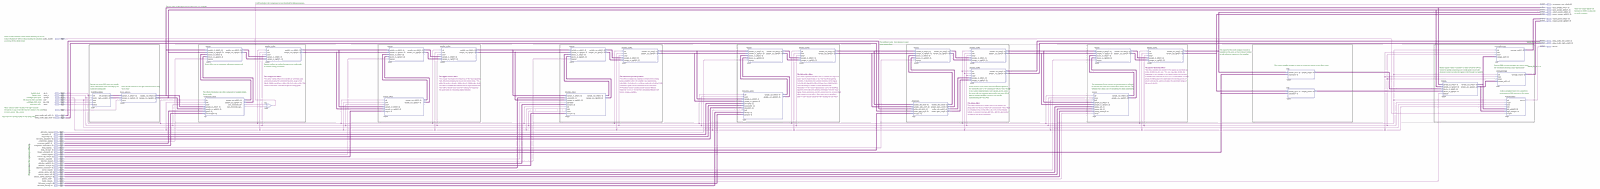
[diagram p0: schematic sheet, whole]
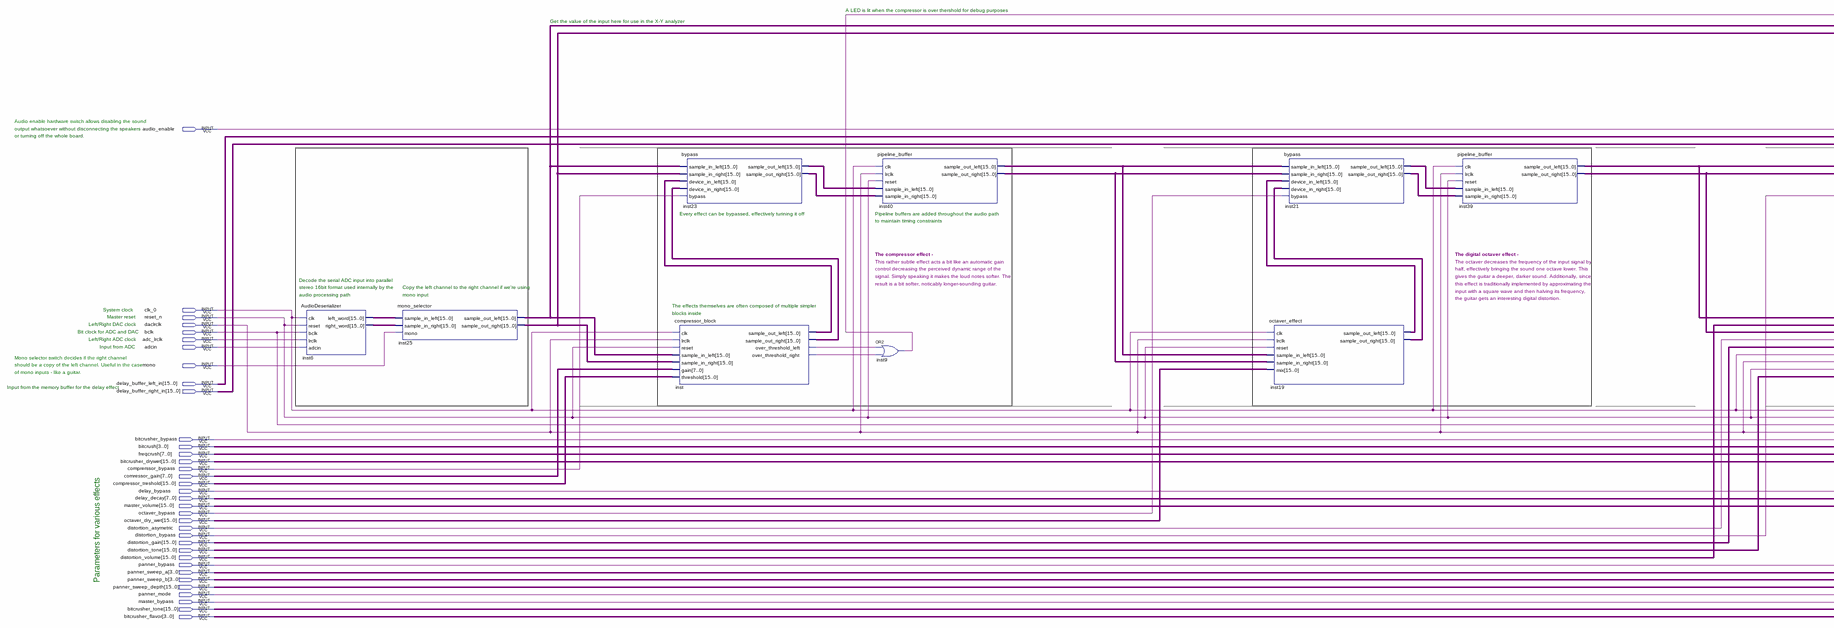
[diagram p1: schematic sheet, left part]
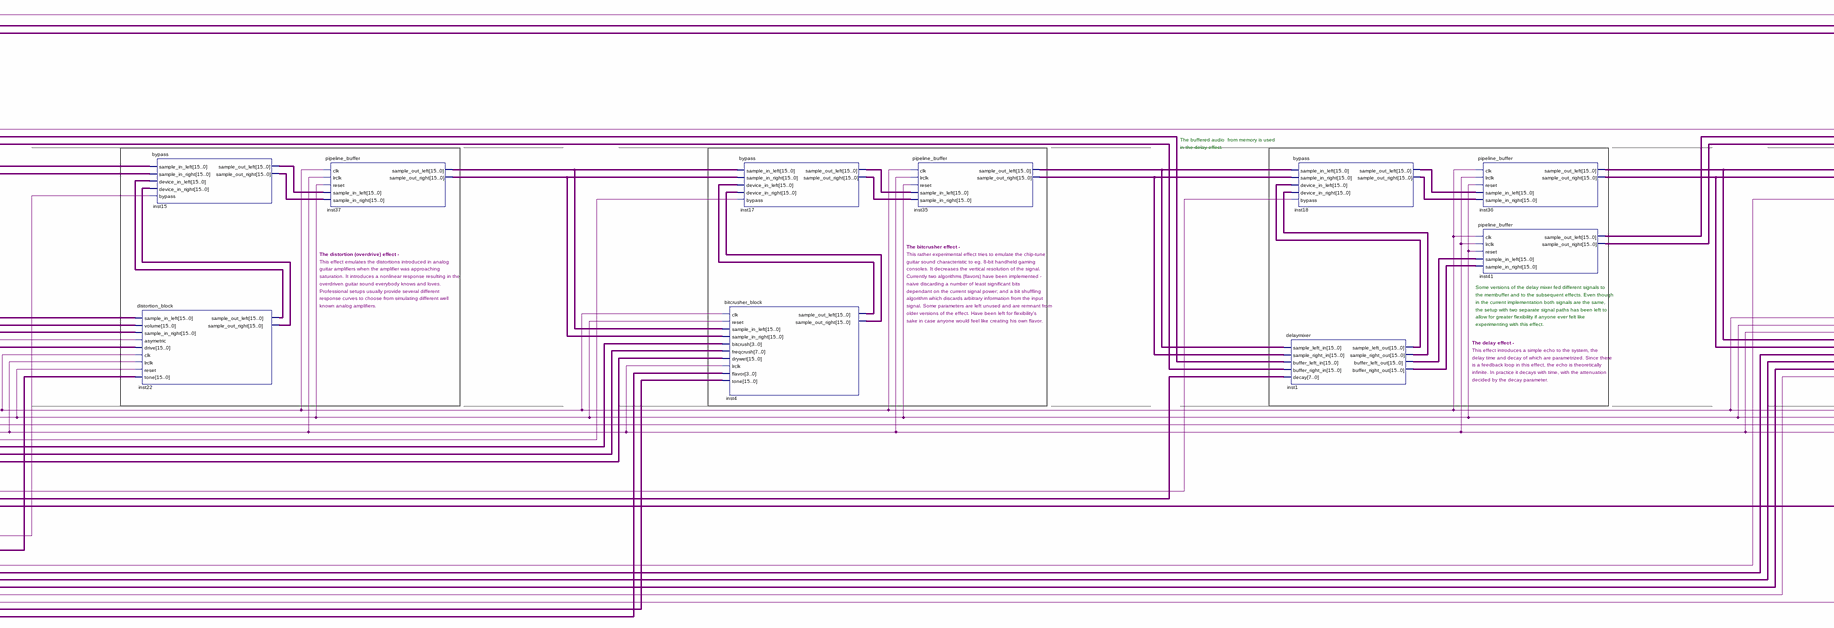
[diagram p2: schematic sheet, centre part]
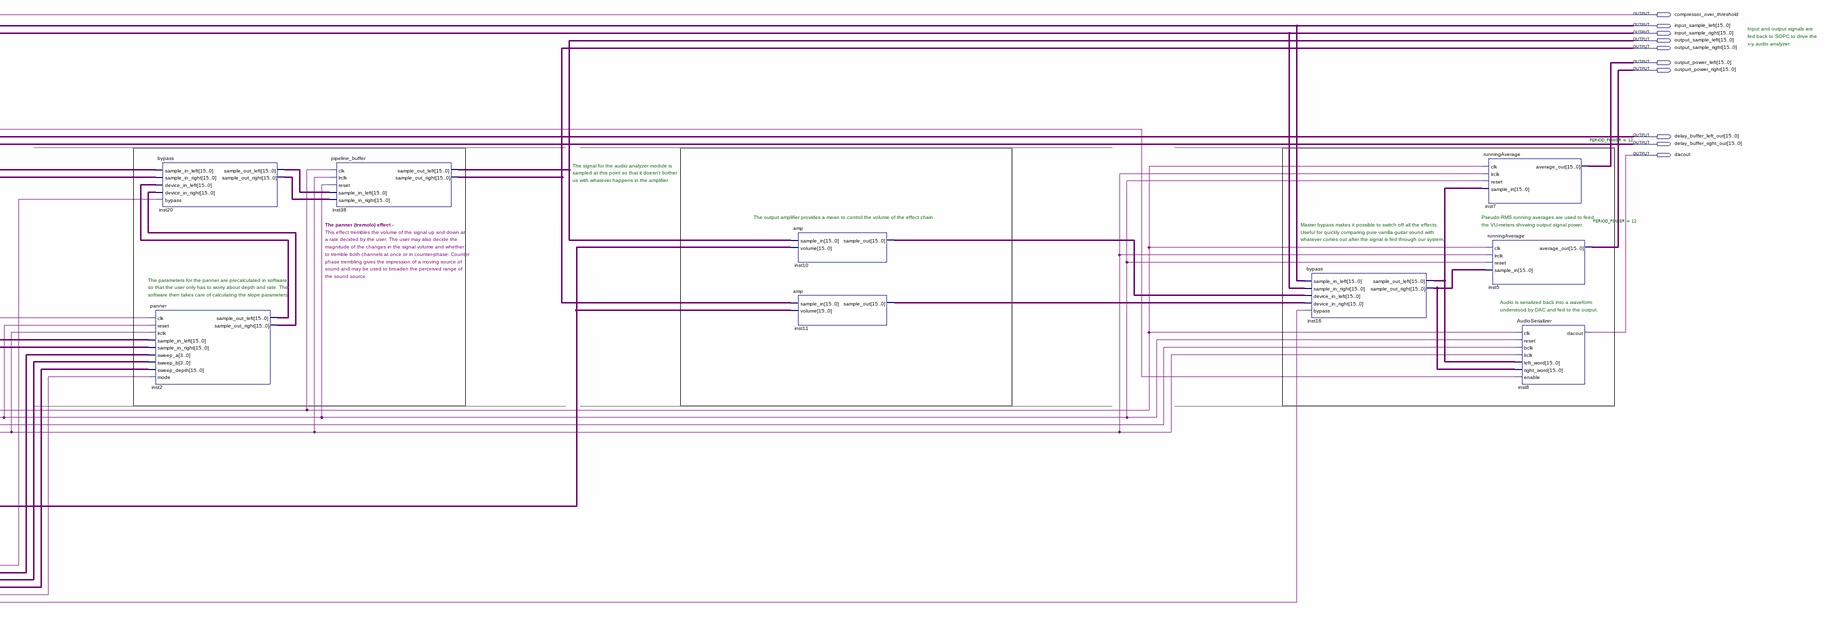
[diagram p3: schematic sheet, right part]
// Quartus schematic audio_two.bdf as structural Verilog: 28 symbols, 45 pins
module audio_two (
  input  audio_enable,
  input  clk_0,
  input  reset_n,
  input  daclrclk,
  input  bclk,
  input  adc_lrclk,
  input  adcin,
  input  mono,
  input  [15:0] delay_buffer_left_in,
  input  [15:0] delay_buffer_right_in,
  input  bitcrusher_bypass,
  input  [3:0] bitcrush,
  input  [7:0] freqcrush,
  input  [15:0] bitcrusher_drywet,
  input  comprerssor_bypass,
  input  [7:0] comressor_gain,
  input  [15:0] compressor_treshold,
  input  delay_bypass,
  input  [7:0] delay_decay,
  input  [15:0] master_volume,
  input  octaver_bypass,
  input  [15:0] octaver_dry_wet,
  input  distortion_asymetric,
  input  distortion_bypass,
  input  [15:0] distortion_gain,
  input  [15:0] distortion_tone,
  input  [15:0] distortion_volume,
  input  panner_bypass,
  input  [3:0] panner_sweep_a,
  input  [3:0] panner_sweep_b,
  input  [15:0] panner_sweep_depth,
  input  panner_mode,
  input  master_bypass,
  input  [15:0] bitcrusher_tone,
  input  [3:0] bitcrusher_flavor,
  output compressor_over_threshold,
  output [15:0] input_sample_left,
  output [15:0] input_sample_right,
  output [15:0] output_sample_left,
  output [15:0] output_sample_right,
  output [15:0] output_power_left,
  output [15:0] outpurt_power_right,
  output [15:0] delay_buffer_left_out,
  output [15:0] delay_buffer_right_out,
  output dacout
);

  wire inst_over_threshold_left, inst_over_threshold_right;
  wire [15:0] inst1_buffer_left_out, inst1_buffer_right_out, inst1_sample_left_out, inst1_sample_right_out,
       inst2_sample_out_left, inst2_sample_out_right, inst4_sample_out_left, inst4_sample_out_right,
       inst6_left_word, inst6_right_word, inst10_sample_out, inst11_sample_out, inst15_sample_out_left,
       inst15_sample_out_right, inst16_sample_out_left, inst16_sample_out_right, inst17_sample_out_left,
       inst17_sample_out_right, inst18_sample_out_left, inst18_sample_out_right, inst19_sample_out_left,
       inst19_sample_out_right, inst20_sample_out_left, inst20_sample_out_right, inst21_sample_out_left,
       inst21_sample_out_right, inst22_sample_out_left, inst22_sample_out_right, inst23_sample_out_left,
       inst23_sample_out_right, inst35_sample_out_left, inst35_sample_out_right, inst36_sample_out_left,
       inst36_sample_out_right, inst37_sample_out_left, inst37_sample_out_right, inst39_sample_out_left,
       inst39_sample_out_right, inst40_sample_out_left, inst40_sample_out_right, inst_sample_out_left,
       inst_sample_out_right;

  AudioDeserializer inst6 (
    .clk(clk_0), .reset(reset_n), .bclk(bclk), .lrclk(adc_lrclk), .adcin(adcin), .left_word(inst6_left_word),
    .right_word(inst6_right_word));
  mono_selector inst25 (
    .sample_in_left(inst6_left_word), .sample_in_right(inst6_right_word), .mono(mono),
    .sample_out_left(input_sample_left), .sample_out_right(input_sample_right));
  bypass inst23 (
    .sample_in_left(input_sample_left), .sample_in_right(input_sample_right),
    .device_in_left(inst_sample_out_left), .device_in_right(inst_sample_out_right),
    .bypass(comprerssor_bypass), .sample_out_left(inst23_sample_out_left),
    .sample_out_right(inst23_sample_out_right));
  compressor_block inst (
    .clk(clk_0), .lrclk(daclrclk), .reset(reset_n), .sample_in_left(input_sample_left),
    .sample_in_right(input_sample_right), .gain(comressor_gain), .threshold(compressor_treshold),
    .sample_out_left(inst_sample_out_left), .sample_out_right(inst_sample_out_right),
    .over_threshold_left(inst_over_threshold_left), .over_threshold_right(inst_over_threshold_right));
  pipeline_buffer inst40 (
    .clk(clk_0), .lrclk(daclrclk), .reset(reset_n), .sample_in_left(inst23_sample_out_left),
    .sample_in_right(inst23_sample_out_right), .sample_out_left(inst40_sample_out_left),
    .sample_out_right(inst40_sample_out_right));
  or inst9 (compressor_over_threshold, inst_over_threshold_left, inst_over_threshold_right);
  bypass inst21 (
    .sample_in_left(inst40_sample_out_left), .sample_in_right(inst40_sample_out_right),
    .device_in_left(inst19_sample_out_left), .device_in_right(inst19_sample_out_right),
    .bypass(octaver_bypass), .sample_out_left(inst21_sample_out_left),
    .sample_out_right(inst21_sample_out_right));
  octaver_effect inst19 (
    .clk(clk_0), .lrclk(daclrclk), .reset(reset_n), .sample_in_left(inst40_sample_out_left),
    .sample_in_right(inst40_sample_out_right), .mix(octaver_dry_wet),
    .sample_out_left(inst19_sample_out_left), .sample_out_right(inst19_sample_out_right));
  pipeline_buffer inst39 (
    .clk(clk_0), .lrclk(daclrclk), .reset(reset_n), .sample_in_left(inst21_sample_out_left),
    .sample_in_right(inst21_sample_out_right), .sample_out_left(inst39_sample_out_left),
    .sample_out_right(inst39_sample_out_right));
  distortion_block inst22 (
    .sample_in_left(inst39_sample_out_left), .volume(distortion_volume),
    .sample_in_right(inst39_sample_out_right), .asymetric(distortion_asymetric), .drive(distortion_gain),
    .clk(clk_0), .lrclk(daclrclk), .reset(reset_n), .tone(distortion_tone),
    .sample_out_left(inst22_sample_out_left), .sample_out_right(inst22_sample_out_right));
  bypass inst15 (
    .sample_in_left(inst39_sample_out_left), .sample_in_right(inst39_sample_out_right),
    .device_in_left(inst22_sample_out_left), .device_in_right(inst22_sample_out_right),
    .bypass(distortion_bypass), .sample_out_left(inst15_sample_out_left),
    .sample_out_right(inst15_sample_out_right));
  pipeline_buffer inst37 (
    .clk(clk_0), .lrclk(daclrclk), .reset(reset_n), .sample_in_left(inst15_sample_out_left),
    .sample_in_right(inst15_sample_out_right), .sample_out_left(inst37_sample_out_left),
    .sample_out_right(inst37_sample_out_right));
  bitcrusher_block inst4 (
    .clk(clk_0), .reset(reset_n), .sample_in_left(inst37_sample_out_left),
    .sample_in_right(inst37_sample_out_right), .bitcrush(bitcrush), .freqcrush(freqcrush),
    .drywet(bitcrusher_drywet), .lrclk(daclrclk), .flavor(bitcrusher_flavor), .tone(bitcrusher_tone),
    .sample_out_left(inst4_sample_out_left), .sample_out_right(inst4_sample_out_right));
  bypass inst17 (
    .sample_in_left(inst37_sample_out_left), .sample_in_right(inst37_sample_out_right),
    .device_in_left(inst4_sample_out_left), .device_in_right(inst4_sample_out_right),
    .bypass(bitcrusher_bypass), .sample_out_left(inst17_sample_out_left),
    .sample_out_right(inst17_sample_out_right));
  pipeline_buffer inst35 (
    .clk(clk_0), .lrclk(daclrclk), .reset(reset_n), .sample_in_left(inst17_sample_out_left),
    .sample_in_right(inst17_sample_out_right), .sample_out_left(inst35_sample_out_left),
    .sample_out_right(inst35_sample_out_right));
  bypass inst18 (
    .sample_in_left(inst35_sample_out_left), .sample_in_right(inst35_sample_out_right),
    .device_in_left(inst1_sample_left_out), .device_in_right(inst1_sample_right_out), .bypass(delay_bypass),
    .sample_out_left(inst18_sample_out_left), .sample_out_right(inst18_sample_out_right));
  delaymixer inst1 (
    .sample_left_in(inst35_sample_out_left), .sample_right_in(inst35_sample_out_right),
    .buffer_left_in(delay_buffer_left_in), .buffer_right_in(delay_buffer_right_in), .decay(delay_decay),
    .sample_left_out(inst1_sample_left_out), .sample_right_out(inst1_sample_right_out),
    .buffer_left_out(inst1_buffer_left_out), .buffer_right_out(inst1_buffer_right_out));
  pipeline_buffer inst36 (
    .clk(clk_0), .lrclk(daclrclk), .reset(reset_n), .sample_in_left(inst18_sample_out_left),
    .sample_in_right(inst18_sample_out_right), .sample_out_left(inst36_sample_out_left),
    .sample_out_right(inst36_sample_out_right));
  pipeline_buffer inst41 (
    .clk(clk_0), .lrclk(daclrclk), .reset(reset_n), .sample_in_left(inst1_buffer_left_out),
    .sample_in_right(inst1_buffer_right_out), .sample_out_left(delay_buffer_left_out),
    .sample_out_right(delay_buffer_right_out));
  panner inst2 (
    .clk(clk_0), .reset(reset_n), .lrclk(daclrclk), .sample_in_left(inst36_sample_out_left),
    .sample_in_right(inst36_sample_out_right), .sweep_a(panner_sweep_a), .sweep_b(panner_sweep_b),
    .sweep_depth(panner_sweep_depth), .mode(panner_mode), .sample_out_left(inst2_sample_out_left),
    .sample_out_right(inst2_sample_out_right));
  bypass inst20 (
    .sample_in_left(inst36_sample_out_left), .sample_in_right(inst36_sample_out_right),
    .device_in_left(inst2_sample_out_left), .device_in_right(inst2_sample_out_right), .bypass(panner_bypass),
    .sample_out_left(inst20_sample_out_left), .sample_out_right(inst20_sample_out_right));
  pipeline_buffer inst38 (
    .clk(clk_0), .lrclk(daclrclk), .reset(reset_n), .sample_in_left(inst20_sample_out_left),
    .sample_in_right(inst20_sample_out_right), .sample_out_left(output_sample_left),
    .sample_out_right(output_sample_right));
  amp inst10 (.sample_in(output_sample_left), .volume(master_volume), .sample_out(inst10_sample_out));
  amp inst11 (.sample_in(output_sample_right), .volume(master_volume), .sample_out(inst11_sample_out));
  bypass inst16 (
    .sample_in_left(input_sample_left), .sample_in_right(input_sample_right),
    .device_in_left(inst10_sample_out), .device_in_right(inst11_sample_out), .bypass(master_bypass),
    .sample_out_left(inst16_sample_out_left), .sample_out_right(inst16_sample_out_right));
  runningAverage #(.PERIOD_POWER(12)) inst7 (
    .clk(clk_0), .lrclk(daclrclk), .reset(reset_n), .sample_in(inst16_sample_out_left),
    .average_out(output_power_left));
  runningAverage #(.PERIOD_POWER(12)) inst5 (
    .clk(clk_0), .lrclk(daclrclk), .reset(reset_n), .sample_in(inst16_sample_out_right),
    .average_out(outpurt_power_right));
  AudioSerializer inst8 (
    .clk(clk_0), .reset(reset_n), .bclk(bclk), .lrclk(daclrclk), .left_word(inst16_sample_out_left),
    .right_word(inst16_sample_out_right), .enable(audio_enable), .dacout(dacout));

  // Notes on the sheet:
  //   A LED is lit when the compressor is over thershold for debug purposes
  //   Get the value of the input here for use in the X-Y analyzer
  //   Input and output signals are
  //   fed back to SOPC to drive the
  //   x-y audio analyzer.
  //   Audio enable hardware switch allows disabling the sound
  //   output whatsoever without disconnecting the speakers
  //   or turning off the whole board.
  //   The buffered audio  from memory is used
  //   in the delay effect
  //   The signal for the audio analyzer module is
  //   sampled at this point so that it doesn't bother
  //   us with whatever happens in the amplifier.
  //   Every effect can be bypassed, effectively turining it off
  //   Pipeline buffers are added throughout the audio path
  //   The output amplifier provides a mean to control the volume of the effect chain.
  //   Pseudo-RMS running averages are used to feed
  //   to maintain timing constraints
  //   The panner (tremolo) effect -
  //   Master bypass makes it possible to switch off all the effects.
  //   the VU-meters showing output signal power.
  //   This effect trembles the volume of the signal up and down at
  //   Useful for quickly comparing pure vanilla guitar sound with
  //   a rate decided by the user. The user may also decide the
  //   whatever comes out after the signal is fed through our system.
  //   The bitcrusher effect -
  //   magnitude of the changes in the signal volume and whether
  //   The compressor effect -
  //   The digital octaver effect -
  //   The distortion (overdrive) effect -
  //   This rather experimental effect tries to emulate the chip-tune
  //   to tremble both channels at once or in counter-phase. Counter
  //   This rather subtle effect acts a bit like an automatic gain
  //   The octaver decreases the frequency of the input signal by
  //   This effect emulates the distortions introduced in analog
  //   guitar sound characteristic to eg. 8-bit handheld gaming
  //   phase trembling gives the impression of a moving source of
  //   control decreasing the perceived dynamic range of the
  //   half, effectively bringing the sound one octave lower. This
  //   guitar amplifiers when the amplifier was approaching
  //   consoles. It decreases the vertical resolution of the signal.
  //   sound and may be used to broaden the perceived range of
  //   signal. Simply speaking it makes the loud notes softer. The
  //   gives the guitar a deeper, darker sound. Additionally, since
  //   saturation. It introduces a nonlinear response resulting in the
  //   Currently two algorithms (flavors) have been implemented -
  //   the sound source.
  //   Decode the serial ADC input into parallel
  //   The parameters for the panner are precalculated in software
  //   result is a bit softer, noticably longer-sounding guitar.
  //   this effect is traditionally implemented by approximating the
  //   overdriven guitar sound everybody knows and loves.
  //   naive discarding a number of least significant bits
  //   stereo 16bit format used internally by the
  //   Copy the left channel to the right channel if we're using
  //   Some versions of the delay mixer fed different signals to
  //   so that the user only has to worry about depth and rate. The
  //   input with a square wave and then halving its frequency,
  //   Professional setups usually provide several different
  //   dependant on the current signal power; and a bit shuffling
  //   audio processing path
  //   mono input
  //   the membuffer and to the subsequent effects. Even though
  //   software then takes care of calculating the slope parameters.
  //   the guitar gets an interesting digital distortion.
  //   response curves to choose from simulating different well
  //   algorithm which discards arbitrary information from the input
  //   in the current implementation both signals are the same,
  //   Audio is serialized back into a waveform
  //   The effects themselves are often composed of multiple simpler
  //   known analog amplifiers.
  //   signal. Some parameters are left unused and are remnant from
  //   System clock
  //   the setup with two separate signal paths has been left to
  //   understood by DAC and fed to the output.
  //   blocks inside
  //   older versions of the effect. Have been left for flexibility's
  //   Master reset
  //   allow for greater flexibility if anyone ever felt like
  //   sake in case anyone would feel like creating his own flavor.
  //   Left/Right DAC clock
  //   experimenting with this effect.
  //   Bit clock for ADC and DAC
  //   Left/Right ADC clock
  //   The delay effect -
  //   Input from ADC
  //   This effect introduces a simple echo to the system, the
  //   Mono selector switch decides if the right channel
  //   delay time and decay of which are parametrized. Since there
  //   should be a copy of the left channel. Useful in the case
  //   is a feedback loop in this effect, the echo is theoretically
  //   of mono inputs - like a guitar.
  //   infinite. In practice it decays with time, with the attenuation
  //   decided by the decay parameter.
  //   Input from the memory buffer for the delay effect
  //   Parameters for various effects
endmodule
